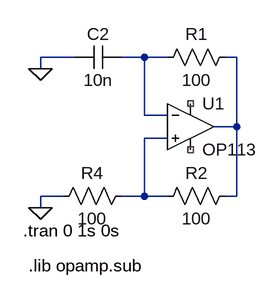
[diagram p0: schematic labo_2_tests.asc]
labo_2_tests.asc, the LTspice schematic file:
Version 4
SHEET 1 880 680
WIRE -64 48 -112 48
WIRE 32 48 0 48
WIRE 64 48 32 48
WIRE 160 48 144 48
WIRE -112 64 -112 48
WIRE 32 128 32 48
WIRE 64 128 32 128
WIRE 160 144 160 48
WIRE 160 144 128 144
WIRE 64 160 32 160
WIRE -80 240 -112 240
WIRE 32 240 32 160
WIRE 32 240 0 240
WIRE 64 240 32 240
WIRE 160 240 160 144
WIRE 160 240 144 240
WIRE -112 256 -112 240
FLAG -112 64 0
FLAG -112 256 0
SYMBOL res 160 32 R90
WINDOW 0 0 56 VBottom 2
WINDOW 3 32 56 VTop 2
SYMATTR InstName R1
SYMATTR Value 100
SYMBOL res 160 224 R90
WINDOW 0 0 56 VBottom 2
WINDOW 3 32 56 VTop 2
SYMATTR InstName R2
SYMATTR Value 100
SYMBOL res 16 224 R90
WINDOW 0 0 56 VBottom 2
WINDOW 3 32 56 VTop 2
SYMATTR InstName R4
SYMATTR Value 100
SYMBOL cap 0 32 R90
WINDOW 0 0 32 VBottom 2
WINDOW 3 32 32 VTop 2
SYMATTR InstName C2
SYMATTR Value 10n
SYMBOL OpAmps\\OP113 96 80 R0
SYMATTR InstName U1
TEXT -136 288 Left 2 !.tran 0 1s 0s
TEXT -128 336 Left 2 !.lib opamp.sub

The netlist it stands for:
* labo_2_tests.asc
R1 N002 N001 100
R2 N002 N003 100
R4 N003 0 100
C2 N001 0 10n
XU1 N003 N001 NC_01 NC_02 N002 OP113  ; pins In+ In- V+ V- OUT
.tran 0 1s 0s
.lib opamp.sub
.lib ADI.lib
.backanno
.end